# Altium schematic sheet main_IO.SchDoc: SDL - Main
size Letter; Author: Ye-Sheng Kuo; Revision: 1; SheetNumber: 4; SheetTotal: 8
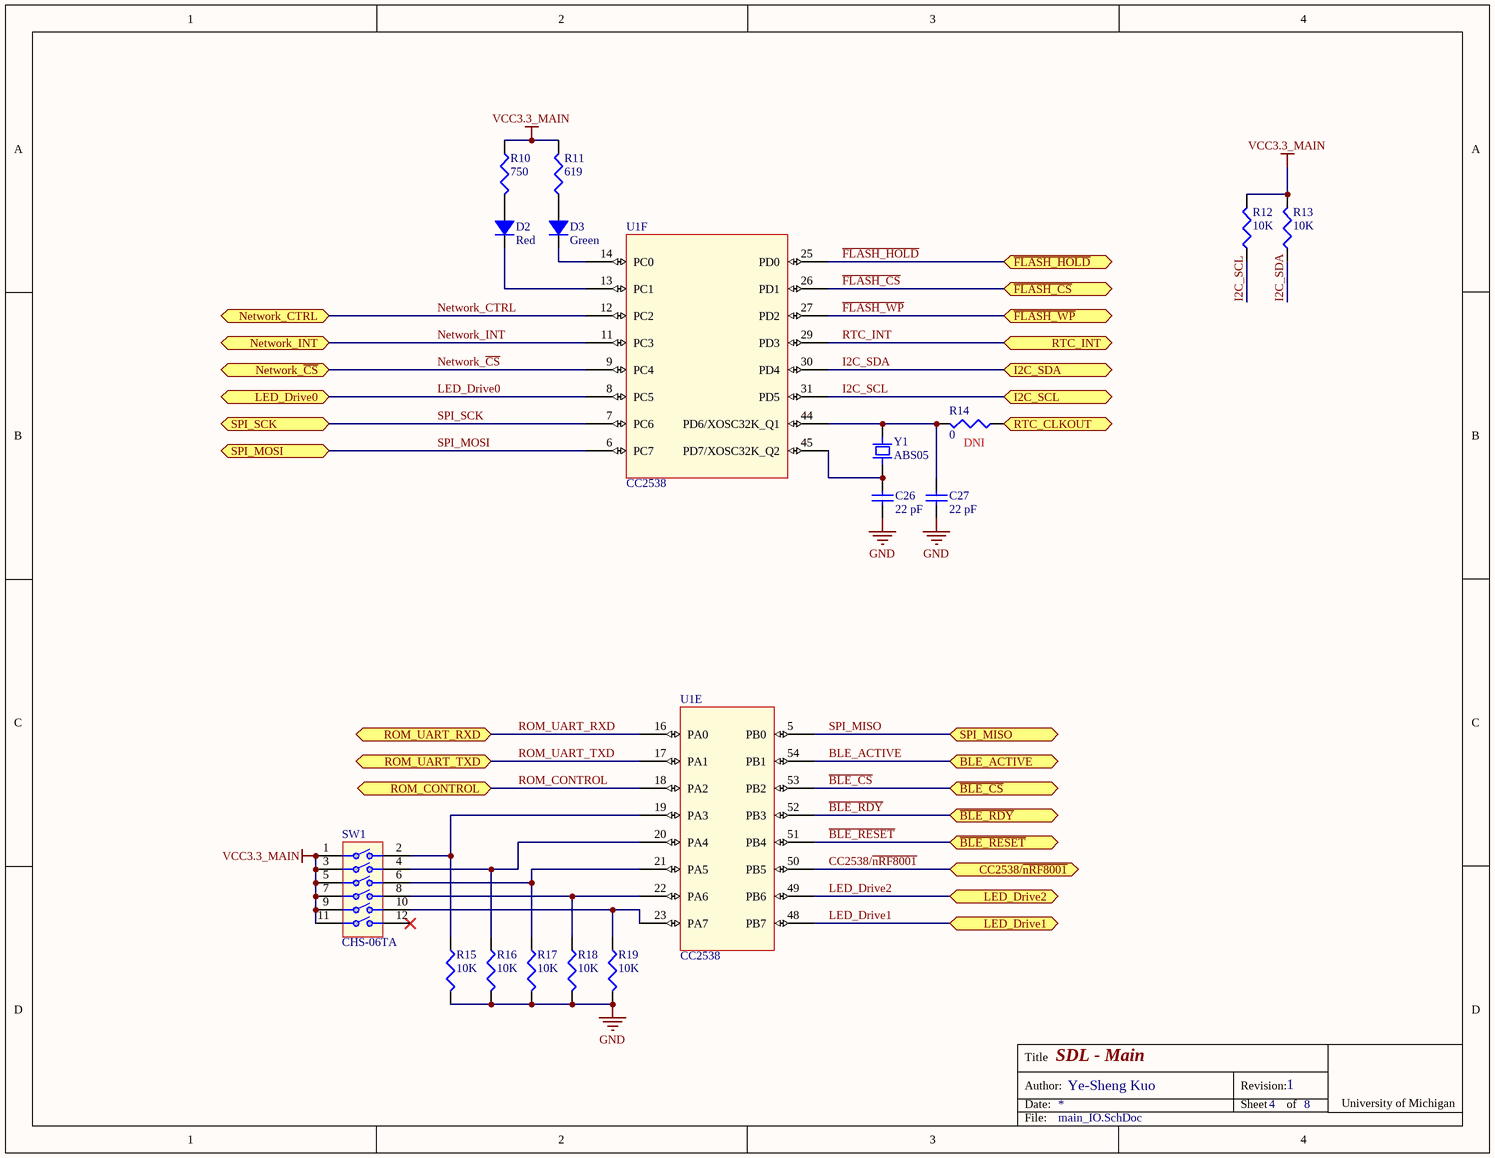
[diagram p0: main_IO.SchDoc]

## Parts
C26  value 22 pF  [0402]  (hidden comment: Ceramic capacitor)
C27  value 22 pF  [0402]  (hidden comment: Ceramic capacitor)
D2  Color: Red  [0402 - DIODE]  (hidden comment: LED, Red)
D3  Color: Green  [0402 - DIODE]  (hidden comment: LED, Green)
R10  value 750  [0402]  (hidden comment: Chip resistor)
R11  value 619  [0402]  (hidden comment: Chip resistor)
R12  value 10K  [0402]  (hidden comment: Chip resistor)
R13  value 10K  [0402]  (hidden comment: Chip resistor)
R14  value 0  [0402]  (hidden comment: Chip resistor)
R15  value 10K  [0402]  (hidden comment: Chip resistor)
R16  value 10K  [0402]  (hidden comment: Chip resistor)
R17  value 10K  [0402]  (hidden comment: Chip resistor)
R18  value 10K  [0402]  (hidden comment: Chip resistor)
R19  value 10K  [0402]  (hidden comment: Chip resistor)
SW1  CHS-06TA  [CHS-06TA]
U1  CC2538  [QFN56]  (parts E,F of 6)
Y1  ABS05  [ABS05]

## Ports
BLE_ACTIVE, CC2538/~{nRF8001}, I2C_SCL, I2C_SDA, LED_Drive0, LED_Drive1, LED_Drive2, Network_CTRL, Network_INT, Network_~{CS}, ROM_CONTROL, ROM_UART_RXD, ROM_UART_TXD, RTC_CLKOUT, RTC_INT, SPI_MISO, SPI_MOSI, SPI_SCK, ~{BLE_CS}, ~{BLE_RDY}, ~{BLE_RESET}, ~{FLASH_CS}, ~{FLASH_HOLD}, ~{FLASH_WP}

## Nets
GND: C26.2 C27.2 R15.1 R16.1 R17.1 R18.1 R19.1
VCC3.3_MAIN: R10.2 R11.1 R12.1 R13.1 SW1.1 SW1.3 SW1.5 SW1.7 SW1.9 SW1.11
~{BLE_CS}: U1.53(PB2) ; port ~{BLE_CS}
~{BLE_RDY}: U1.52(PB3) ; port ~{BLE_RDY}
~{BLE_RESET}: U1.51(PB4) ; port ~{BLE_RESET}
BLE_ACTIVE: U1.54(PB1) ; port BLE_ACTIVE
CC2538/~{nRF8001}: U1.50(PB5) ; port CC2538/~{nRF8001}
~{FLASH_CS}: U1.26(PD1) ; port ~{FLASH_CS}
~{FLASH_HOLD}: U1.25(PD0) ; port ~{FLASH_HOLD}
~{FLASH_WP}: U1.27(PD2) ; port ~{FLASH_WP}
I2C_SCL: R12.2 U1.31(PD5) ; port I2C_SCL
I2C_SDA: R13.2 U1.30(PD4) ; port I2C_SDA
LED_Drive0: U1.8(PC5) ; port LED_Drive0
LED_Drive1: U1.48(PB7) ; port LED_Drive1
LED_Drive2: U1.49(PB6) ; port LED_Drive2
Network_~{CS}: U1.9(PC4) ; port Network_~{CS}
Network_CTRL: U1.12(PC2) ; port Network_CTRL
Network_INT: U1.11(PC3) ; port Network_INT
ROM_CONTROL: U1.18(PA2) ; port ROM_CONTROL
ROM_UART_RXD: U1.16(PA0) ; port ROM_UART_RXD
ROM_UART_TXD: U1.17(PA1) ; port ROM_UART_TXD
RTC_CLKOUT: R14.2 ; port RTC_CLKOUT
RTC_INT: U1.29(PD3) ; port RTC_INT
SPI_MISO: U1.5(PB0) ; port SPI_MISO
SPI_MOSI: U1.6(PC7) ; port SPI_MOSI
SPI_SCK: U1.7(PC6) ; port SPI_SCK
NetC26_1: C26.1 U1.45(PD7/XOSC32K_Q2) Y1.2
NetC27_1: C27.1 R14.1 U1.44(PD6/XOSC32K_Q1) Y1.1
NetD2_1: D2.1 R10.1
NetD2_2: D2.2 U1.13(PC1)
NetD3_1: D3.1 R11.2
NetD3_2: D3.2 U1.14(PC0)
NetR15_2: R15.2 SW1.2 U1.19(PA3)
NetR16_2: R16.2 SW1.4 U1.20(PA4)
NetR17_2: R17.2 SW1.6 U1.21(PA5)
NetR18_2: R18.2 SW1.8 U1.22(PA6)
NetR19_2: R19.2 SW1.10 U1.23(PA7)

Not connected (* = marked no-connect by the designer): SW1 12*

## Notes on the sheet
- (near R14) DNI
- Title
- Date:
- Author:
- Revision:
- Sheet
- of
- University of Michigan
- File:

## Library data of the parts
C26 C27 = C_22p_0402_ceramic: Ceramic capacitor, 22 pF, 0402 package; Manufacture: Johanson; voltage rated: 50 V; tolerance: 2%; package: 0402; Supplier 1: Digi-Key; Supplier Part Number 1: 712-1274-1-ND
D2 = D_LED_RED_0402: LED, Red, 0402; package: 0402; Supplier 1: Digi-Key; Supplier Part Number 1: 511-1593-1-ND
D3 = D_LED_GREEN_0402: LED, Green,  0402; package: 0402; Supplier 1: Digi-Key; Supplier Part Number 1: 511-1592-1-ND
R10 = R_750_0402: Chip resistor, 750, 0402 package; tolerance: 1%; power: 1/16 W; package: 0402; Supplier 1: Digi-Key; Supplier Part Number 1: 541-750LCT-ND
R11 = R_619_0402: Chip resistor, 619, 0402 package; tolerance: 1%; power: 1/16 W; package: 0402; Supplier 1: Digi-Key; Supplier Part Number 1: 541-619LCT-ND
R12 R13 R15-R19 = R_10K_0402: Chip resistor, 10K, 0402 package; tolerance: 1%; power: 1/16 W; Supplier 1: Digi-Key; Supplier Part Number 1: 541-10.0KLDKR-ND; package: 0402
R14 = R_0_0402: Chip resistor, 0, 0402 package; package: 0402; Supplier 1: Digi-Key; Supplier Part Number 1: 541-0.0YBCT-ND
SW1 = CHS-06TA: SLIDE SWITCHES; Supplier 1: Digi-Key; Supplier Part Number 1: 563-1009-1-ND
U1 = CC2538: A Powerful System-On-Chip for 2.4-GHz IEEE 802.15.4, 6LoWPAN  and ZigBee Applications; Supplier 1: Digi-Key; Supplier Part Number 1: 296-35797-1-ND
Y1 = ABS05: 32768 Hz SMD Low profile crystal; Supplier 1: Digi-Key; Supplier Part Number 1: 535-11899-1-ND